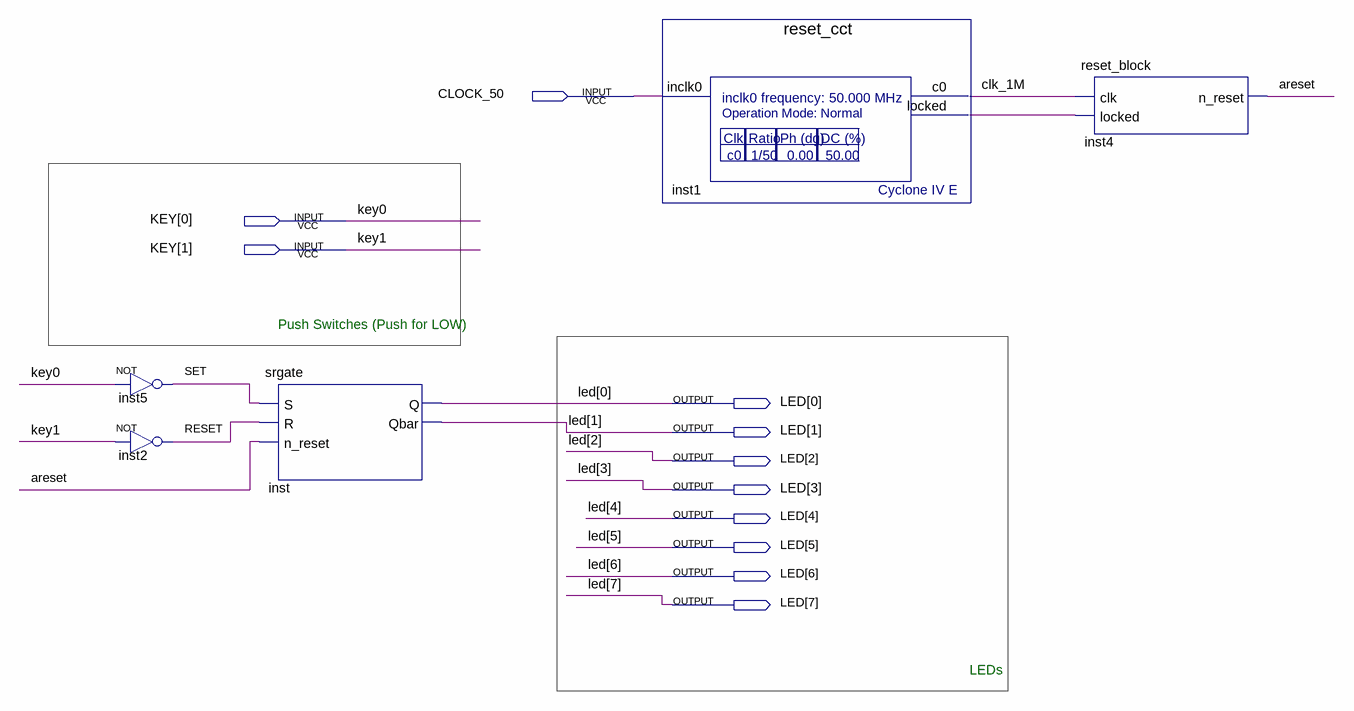
[diagram p0: schematic sheet]
// Quartus schematic TopLevelSchematic.bdf as structural Verilog: 5 symbols, 11 pins
module TopLevelSchematic (
  input  CLOCK_50,
  input  [1:0] KEY,
  output [7:0] LED
);

  wire areset, clk_1M, inst1_locked, RESET, SET;

  not inst5 (SET, KEY[0]);
  not inst2 (RESET, KEY[1]);
  srgate inst (.R(RESET), .S(SET), .n_reset(areset), .Q(LED[0]), .Qbar(LED[1]));
  reset_cct inst1 (.inclk0(CLOCK_50), .c0(clk_1M), .locked(inst1_locked));
  reset_block inst4 (.clk(clk_1M), .locked(inst1_locked), .n_reset(areset));

  // Notes on the sheet:
  //   Push Switches (Push for LOW)
  //   LEDs
endmodule
